# Altium schematic sheet Power_Supply.SchDoc: Power Supply
size A4; CompanyName: St. Cloud State University; Organization: Senior Design Project; Address1: Prosthetic Hand; Address2: Matthew Varas; Address3: Rachel Mertz; Address4: Donnell Jones; DocumentNumber: 4; Revision: 1.1; SheetNumber: 4; SheetTotal: 5
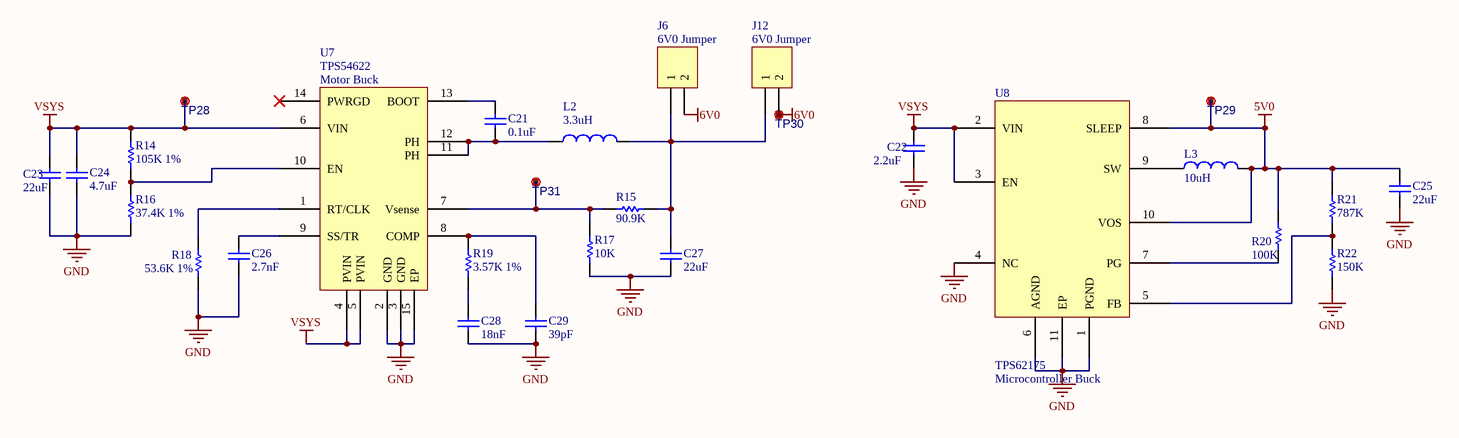
[diagram p0: Power_Supply.SchDoc]

## Parts
C21  0.1uF  [CAPC0805(2012)145_N]
C22  2.2uF  [CAPC0603(1608)100_N]
C23  22uF  [CAPC1206(3216)190_N]
C24  4.7uF  [CAPC0805(2012)145_N]
C25  22uF  [CAPC0805(2012)145_N]
C26  2.7nF  [CAPC0805(2012)145_N]
C27  22uF  [CAPC1206(3216)190_N]
C28  18nF  [CAPC0805(2012)145_N]
C29  39pF  [CAPC0805(2012)100_N]
J6  6V0 Jumper  [HDR1X2]
J12  6V0 Jumper  [HDR1X2]
L2  3.3uH  [INDM7265X40N]
L3  10uH  [SDR0503]
R14  105K 1%  [RESC0402(1005)_N]
R15  90.9K  [RESC0402(1005)_N]
R16  37.4K 1%  [RESC0402(1005)_N]
R17  10K  [RESC0402(1005)_N]
R18  53.6K 1%  [RESC0402(1005)_N]
R19  3.57K 1%  [RESC0402(1005)_N]
R20  100K  [RESC0402(1005)_N]
R21  787K  [RESC0603(1608)_N]
R22  150K  [RESC0603(1608)_N]
TP28  Test Point  [Testpoint_70]  (value not drawn)
TP29  Test Point  [Testpoint_70]  (value not drawn)
TP30  Test Point  [Testpoint_70]  (value not drawn)
TP31  Test Point  [Testpoint_70]  (value not drawn)
U7  TPS54622  Desc: Motor Buck  [S-PVQFN-N14]
U8  TPS62175  Desc: Microcontroller Buck  [R-PWSON-N10]

## Nets
5V0: C25.2 L3.2 R20.2 R21.1 TP29.1(M80) U8.8(SLEEP) U8.10(VOS)
6V0: J6.2 J12.2 TP30.1(M80)
GND: C22.1 C23.1 C24.1 C25.1 C26.1 C27.1 C28.1 C29.1 R16.1 R17.1 R18.1 R22.1 U7.2(GND) U7.3(GND) U7.15(EP) U8.1(PGND) U8.4(NC) U8.6(AGND) U8.11(EP)
VSYS: C22.2 C23.2 C24.2 R14.1 TP28.1(M80) U7.4(PVIN) U7.5(PVIN) U7.6(VIN) U8.2(VIN) U8.3(EN)
NetC21_1: C21.1 L2.1 U7.11(PH) U7.12(PH)
NetC21_2: C21.2 U7.13(BOOT)
NetC26_2: C26.2 U7.9(SS/TR)
NetC27_2: C27.2 J6.1 J12.1 L2.2 R15.2
NetC28_2: C28.2 R19.1
NetC29_2: C29.2 R19.2 U7.8(COMP)
NetL3_1: L3.1 U8.9(SW)
NetR14_2: R14.2 R16.2 U7.10(EN)
NetR15_1: R15.1 R17.2 TP31.1(M80) U7.7(Vsense)
NetR18_2: R18.2 U7.1(RT/CLK)
NetR20_1: R20.1 U8.7(PG)
NetR21_2: R21.2 R22.2 U8.5(FB)

Not connected (* = marked no-connect by the designer): U7 14(PWRGD)*

## Notes on the sheet
- Title
- Size:
- Date:
- A4
- Number:
- Time:
- Revision:
- Sheet
- of
- File:

## Library data of the parts
C21 = CMP-1036-04410-1: CAP CER 0.1UF 25V X7R 0805; Case-Metric: 2012; Case-EIA: 0805; Tolerance: Â±10%; MFG_PN01: 08053C104KAT2A; MFG_NAME01: AVX; DIGI_PN01: 478-3755-1-ND; Technology: SMT; Value: 0.1uF; Rated Voltage: 25 V; Max Thickness: 1.45 mm
C22 = CMP-1035-02763-1: CAP CER 2.2UF 16V X5R 0603; Case-Metric: 1608; Case-EIA: 0603; Tolerance: Â±10%; MFG_PN01: GRM188R61C225KE15D; MFG_NAME01: Murata; DIGI_PN01: 490-3296-2-ND; Value: 2.2uF; Max Thickness: 1 mm; Technology: SMT; Rated Voltage: 16 V
C23 = CMP-1037-04993-1: CAP CER 22UF 16V X5R 1206; Tolerance: Â±20%; Case-Metric: 3216; Case-EIA: 1206; MFG_PN01: GRM31CR61C226ME15L; DIGI_PN01: 490-4739-1-ND; MFG_NAME01: Murata; Value: 22uF; Rated Voltage: 16 V; Technology: SMT; Max Thickness: 1.9 mm
C24 = CMP-1036-04895-1: CAP CER 4.7UF 25V X5R 0805; Case-Metric: 2012; Case-EIA: 0805; Tolerance: Â±10%; MFG_PN01: GRM21BR61E475KA12L; MFG_NAME01: Murata; DIGI_PN01: 490-3335-1-ND; Value: 4.7uF; Technology: SMT; Rated Voltage: 25 V; Max Thickness: 1.45 mm
C25 = CMP-1036-04939-1: CAP CER 22UF 6.3V X5R 0805; Case-EIA: 0805; Tolerance: Â±20%; Case-Metric: 2012; MFG_PN01: GRM21BR60J226ME39L; MFG_NAME01: Murata; DIGI_PN01: 490-1719-1-ND; Max Thickness: 1.45 mm; Technology: SMT; Rated Voltage: 6.3 V; Value: 22uF
C26 = CMP-1036-03344-1: CAP CER 2700PF 50V X7R 0805; Tolerance: Â±10%; Case-Metric: 2012; Case-EIA: 0805; MFG_PN01: CC0805KRX7R9BB272; MFG_NAME01: Yageo; DIGI_PN01: 311-1130-1-ND; Value: 2.7nF; Max Thickness: 1.45 mm; Technology: SMT; Rated Voltage: 50 V
C27 = CMP-1037-04989-1: CAP CER 22UF 10V X5R 1206; Tolerance: Â±10%; Case-EIA: 1206; Case-Metric: 3216; MFG_PN01: GRM31CR61A226KE19L; MFG_NAME01: Murata; DIGI_PN01: 490-6510-1-ND; Max Thickness: 1.9 mm; Value: 22uF; Technology: SMT; Rated Voltage: 10 V
C28 = CMP-1036-04012-1: CAP CER 0.018UF 50V X7R 0805; Tolerance: Â±10%; Case-EIA: 0805; Case-Metric: 2012; MFG_PN01: CC0805KRX7R9BB183; MFG_NAME01: Yageo; DIGI_PN01: 311-1137-1-ND; Value: 18nF; Max Thickness: 1.45 mm; Rated Voltage: 50 V; Technology: SMT
C29 = CMP-1036-01521-1: CAP CER 39PF 50V NPO 0805; Case-Metric: 2012; Case-EIA: 0805; Tolerance: Â±5%; MFG_PN01: CC0805JRNPO9BN390; MFG_NAME01: Yageo; DIGI_PN01: 311-1106-1-ND; Technology: SMT; Rated Voltage: 50 V; Max Thickness: 1 mm; Value: 39pF
J6 J12 = Header 2: PEC02SAAN; MFG_NAME01: Sullins Connector Solutions; DIGI_PN01: S1012E-02-ND; LatestRevisionDate: 17-Jul-2002; LatestRevisionNote: Re-released for DXP Platform.; Publisher: Altium Limited; MFG_PN01: PEC02SAAN
L2 = Inductor: FIXED IND 3.3UH 6.5A 23 MOHM SMD; Code_IEC: 1005; MFG_PN01: SRP6540-3R3M; MFG_NAME01: Bourns; DIGI_PN01: SRP6540-3R3MCT-ND; Published: 8-Jun-2000; LatestRevisionDate: 29-May-2009; LatestRevisionNote: IPC-7351 Footprint Added.; PackageReference: Nonstandard; Publisher: Altium Limited; PackageDescription: Chip Inductor; Value: 3.3uH
L3 = Inductor: FIXED IND 10UH 1.3A 130 MOHM SMD; Code_IEC: 1005; Value: 10mH; MFG_PN01: SDR0503-100ML; MFG_NAME01: Bourns; DIGI_PN01: SDR0503-100MLCT-ND; Published: 8-Jun-2000; LatestRevisionDate: 29-May-2009; LatestRevisionNote: IPC-7351 Footprint Added.; PackageReference: 0402-A; Publisher: Altium Limited; PackageDescription: Chip Inductor; Code_JEITA: 0402
R14 = CMP-1011-00122-1: RES SMD 105K OHM 1% 1/16W 0402; Power: 0.063 W; Case-EIA: 0402; Case-Metric: 1005; MFG_PN01: CRCW0402105KFKED; MFG_NAME01: Vishay Dale; DIGI_PN01: 541-105KLCT-ND; Value: 105k; Technology: SMT; Tolerance: 1%
R15 = CMP-1011-00731-1: RES SMD 90.9K OHM 1% 1/16W 0402; Case-EIA: 0402; Power: 0.063 W; Case-Metric: 1005; MFG_PN01: CRCW040290K9FKED; MFG_NAME01: Vishay Dale; DIGI_PN01: 541-90.9KLCT-ND; Tolerance: 1 %; Technology: SMT; Value: 90.9K
R16 = CMP-1011-00111-1: RES SMD 37.4K OHM 1% 1/16W 0402; Case-EIA: 0402; Power: 0.063 W; Case-Metric: 1005; DIGI_PN01: 541-37.4KLCT-ND; MFG_PN01: CRCW040237K4FKED; MFG_NAME01: Vishay Dale; Value: 37.4K; Technology: SMT; Tolerance: 1%
R17 = CMP-1011-00623-1: RES SMD 10K OHM 1% 1/16W 0402; Case-Metric: 1005; Case-EIA: 0402; Power: 0.063 W; MFG_PN01: CRCW040210K0FKED; MFG_NAME01: Vishay Dale; DIGI_PN01: 541-10.0KLCT-ND; Value: 10K; Tolerance: 1 %; Technology: SMT
R18 = CMP-1011-00111-1: RES SMD 53.6K OHM 1% 1/16W 0402; Case-EIA: 0402; Power: 0.063 W; Case-Metric: 1005; MFG_PN01: CRCW040253K6FKED; MFG_NAME01: Vishay Dale; DIGI_PN01: 541-53.6KLCT-ND; Value: 53.6K; Technology: SMT; Tolerance: 1%
R19 = CMP-1011-00571-1: RES SMD 3.57K OHM 1% 1/16W 0402; Case-Metric: 1005; Case-EIA: 0402; Power: 0.063 W; MFG_PN01: CRCW04023K57FKED; MFG_NAME01: Vishay Dale; DIGI_PN01: 541-3.57KLCT-ND; Value: 3.57K; Technology: SMT; Tolerance: 1 %
R20 = CMP-1011-00122-1: RES SMD 100K OHM 1% 1/16W 0402; Power: 0.063 W; Case-EIA: 0402; Case-Metric: 1005; MFG_PN01: CRCW0402100KFKED; MFG_NAME01: Vishay Dale; DIGI_PN01: 541-100KLCT-ND; Value: 100k; Technology: SMT; Tolerance: 1 %
R21 = CMP-1012-00247-1: RES SMD 787K OHM 1% 1/10W 0603; Case-EIA: 0603; Power: 0.1 W; Case-Metric: 1608; MFG_PN01: RC0603FR-07787KL; MFG_NAME01: Yageo; DIGI_PN01: 311-787KHRCT-ND; Value: 787K Ohm; Technology: SMT; Tolerance: 1 %
R22 = CMP-1012-00247-1: RES SMD 150K OHM 1% 1/10W 0603; Case-EIA: 0603; Power: 0.1 W; Case-Metric: 1608; Tolerance: 0.1 %; MFG_PN01: RT0603BRD07150KL; MFG_NAME01: Yageo; DIGI_PN01: YAG1532CT-ND; Value: 150K Ohm; Technology: SMT
TP28-TP31 = Test Point: Test Pad; MFG_PN01: DNP; MFG_NAME01: DNP; DNP: DNP
U7 = TPS54622: IC REG BUCK ADJ 6A SYNC 14QFN; MFG_PN01: TPS54622RHLR; MFG_NAME01: Texas Instruments; DIGI_PN01: 296-29204-1-ND; Case-EIA: 14-VFQFN
U8 = TPS62175: IC REG BUCK BST 5V 0.8A 10WSON; MFG_NAME01: Texas Instruments; MFG_PN01: TPS62175DQCR; DIGI_PN01: 296-39451-1-ND; Case-EIA: 10-WFDFN